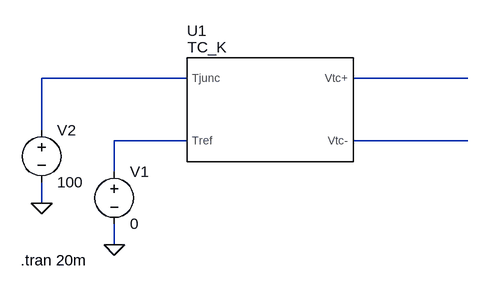
[diagram p0: schematic K_Type.asc]
K_Type.asc, the LTspice schematic file:
Version 4.1
SHEET 1 880 680
WIRE 144 80 -80 80
WIRE 576 80 400 80
WIRE -80 160 -80 80
WIRE 144 176 32 176
WIRE 576 176 400 176
WIRE 32 224 32 176
WIRE -80 272 -80 240
WIRE 32 336 32 304
FLAG 32 336 0
FLAG -80 272 0
SYMBOL voltage 32 208 R0
WINDOW 123 0 0 Left 0
WINDOW 39 0 0 Left 0
SYMATTR InstName V1
SYMATTR Value 0
SYMBOL voltage -80 144 R0
WINDOW 123 0 0 Left 0
WINDOW 39 0 0 Left 0
SYMATTR InstName V2
SYMATTR Value 100
SYMBOL MyLib\\Sensor_TC\\K_Type 272 112 R0
SYMATTR InstName U1
TEXT -112 360 Left 2 !.tran 20m

The netlist it stands for:
* K_Type.asc
V1 N003 0 0
V2 N001 0 100
X§U1 N001 N003 N002 N004 TC_K  ; pins Tjunc Tref Vtc+ Vtc-
.tran 20m
.lib MyLib/Sensor_TC/K_Type.lib
.backanno
.end